# Altium schematic sheet SmartCantonDevBox_TopPage.SchDoc: Top View
size A4; Engineer: David; DocumentNumber: 1; SheetNumber: 1; SheetTotal: 9; Project: SmartCanton Dev Box; Labo: LSN; PageSetup: Record=PageOptions|CenterHorizontal=True|CenterVertical=True|PrintScale=0.97|XCorrection=1.00|YCorrection=1.00|PrintKind=1|BorderSize=5000000|LeftOffset=0|BottomOffset=0|Orientation=2|PaperLength=1000|PaperWidth=1000|Scale=100|PaperSource=7|PrintQuality=-3|MediaType=1|DitherType=10|PrintScaleMode=1|PaperKind=A4 (210 x 297 mm)|PaperIndex=9
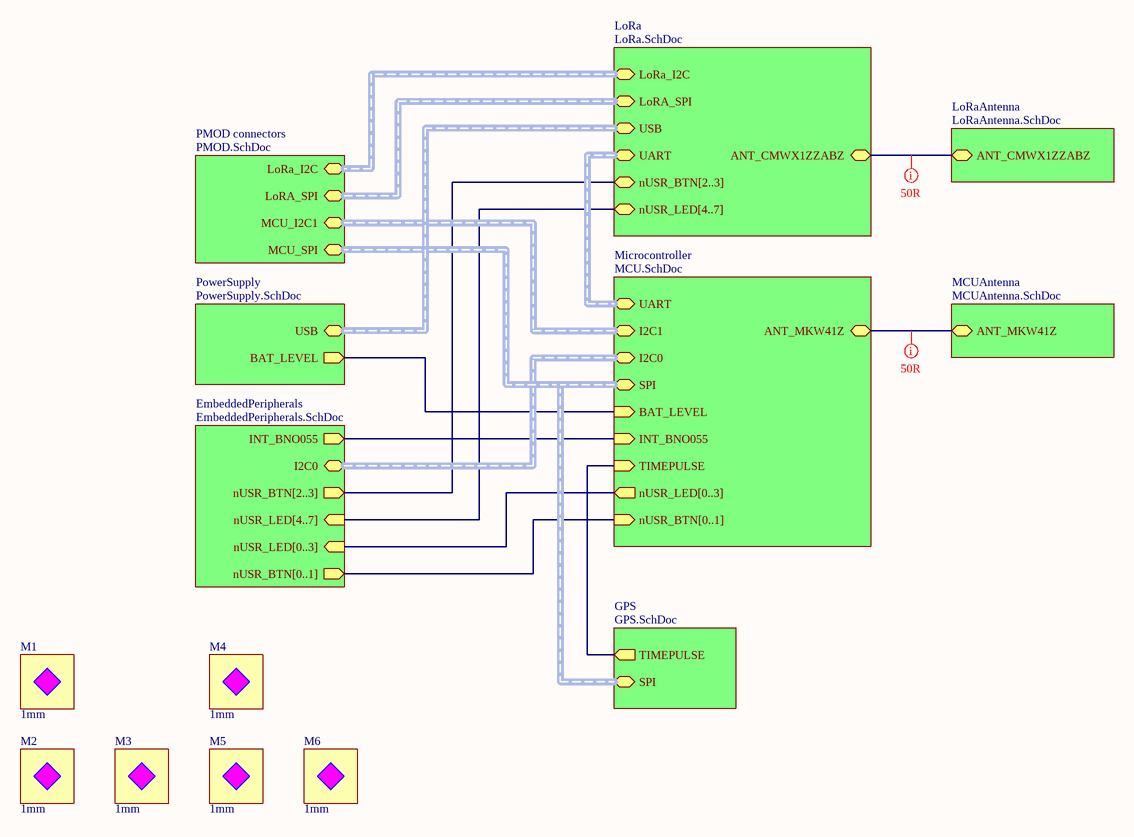
[diagram p0: SmartCantonDevBox_TopPage.SchDoc]

## Parts
M1  1mm  [Losange-1mm]
M2  1mm  [Losange-1mm]
M3  1mm  [Losange-1mm]
M4  1mm  [Losange-1mm]
M5  1mm  [Losange-1mm]
M6  1mm  [Losange-1mm]

## Sub-sheets
EmbeddedPeripherals = EmbeddedPeripherals.SchDoc: I2C0 (harness I2C), INT_BNO055 (out), nUSR_LED[0..3] (in), nUSR_LED[4..7] (in), nUSR_BTN[0..1] (out), nUSR_BTN[2..3] (out)
GPS = GPS.SchDoc: SPI (harness SPI), TIMEPULSE (out)
LoRa = LoRa.SchDoc: ANT_CMWX1ZZABZ, UART (harness UART), nUSR_BTN[2..3], nUSR_LED[4..7], USB (harness USB), LoRA_SPI (harness SPI_LoRa), LoRa_I2C (harness I2C_LoRa)
LoRaAntenna = LoRaAntenna.SchDoc: ANT_CMWX1ZZABZ
MCUAntenna = MCUAntenna.SchDoc: ANT_MKW41Z
Microcontroller = MCU.SchDoc: SPI (harness SPI), I2C1 (harness I2C), I2C0 (harness I2C), ANT_MKW41Z, UART (harness UART), BAT_LEVEL (in), TIMEPULSE (in), INT_BNO055 (in), nUSR_LED[0..3] (out), nUSR_BTN[0..1] (in)
PMOD connectors = PMOD.SchDoc: MCU_SPI (harness SPI), MCU_I2C1 (harness I2C), LoRA_SPI (harness SPI_LoRa), LoRa_I2C (harness I2C_LoRa)
PowerSupply = PowerSupply.SchDoc: BAT_LEVEL (out), USB (harness USB)

## Nets
(unnamed): sheet GPS/TIMEPULSE, sheet Microcontroller/TIMEPULSE
(unnamed): sheet Microcontroller/ANT_MKW41Z, sheet MCUAntenna/ANT_MKW41Z
(unnamed): sheet Microcontroller/BAT_LEVEL, sheet PowerSupply/BAT_LEVEL
(unnamed): sheet Microcontroller/INT_BNO055, sheet EmbeddedPeripherals/INT_BNO055
(unnamed): sheet LoRa/ANT_CMWX1ZZABZ, sheet LoRaAntenna/ANT_CMWX1ZZABZ

## Buses and harness runs
bus sheet EmbeddedPeripherals/nUSR_BTN[0..1] = sheet Microcontroller/nUSR_BTN[0..1]
bus sheet EmbeddedPeripherals/nUSR_BTN[2..3] = sheet LoRa/nUSR_BTN[2..3]
bus sheet EmbeddedPeripherals/nUSR_LED[0..3] = sheet Microcontroller/nUSR_LED[0..3]
bus sheet EmbeddedPeripherals/nUSR_LED[4..7] = sheet LoRa/nUSR_LED[4..7]
harness sheet EmbeddedPeripherals/I2C0 = sheet Microcontroller/I2C0
harness sheet GPS/SPI = sheet Microcontroller/SPI = sheet PMOD connectors/MCU_SPI
harness sheet LoRa/LoRa_I2C = sheet PMOD connectors/LoRa_I2C
harness sheet LoRa/LoRA_SPI = sheet PMOD connectors/LoRA_SPI
harness sheet LoRa/UART = sheet Microcontroller/UART
harness sheet LoRa/USB = sheet PowerSupply/USB
harness sheet Microcontroller/I2C1 = sheet PMOD connectors/MCU_I2C1

## Layout directives
rule Impedance Constraint [Min = 49.50    Max = 50.50    ]; net class 50R: (no net found under the mark)

## Notes on the sheet
- Title:
- Date:
- Project:
- Engineer:
- Revision:
- Sheet
- of
- Labo:
- File:

## Library data of the parts
M1-M6 = CMP-001-0056-A.1: Losange 1mm